# EAGLE design Ikea_Molgan (EAGLE 8.2.2)
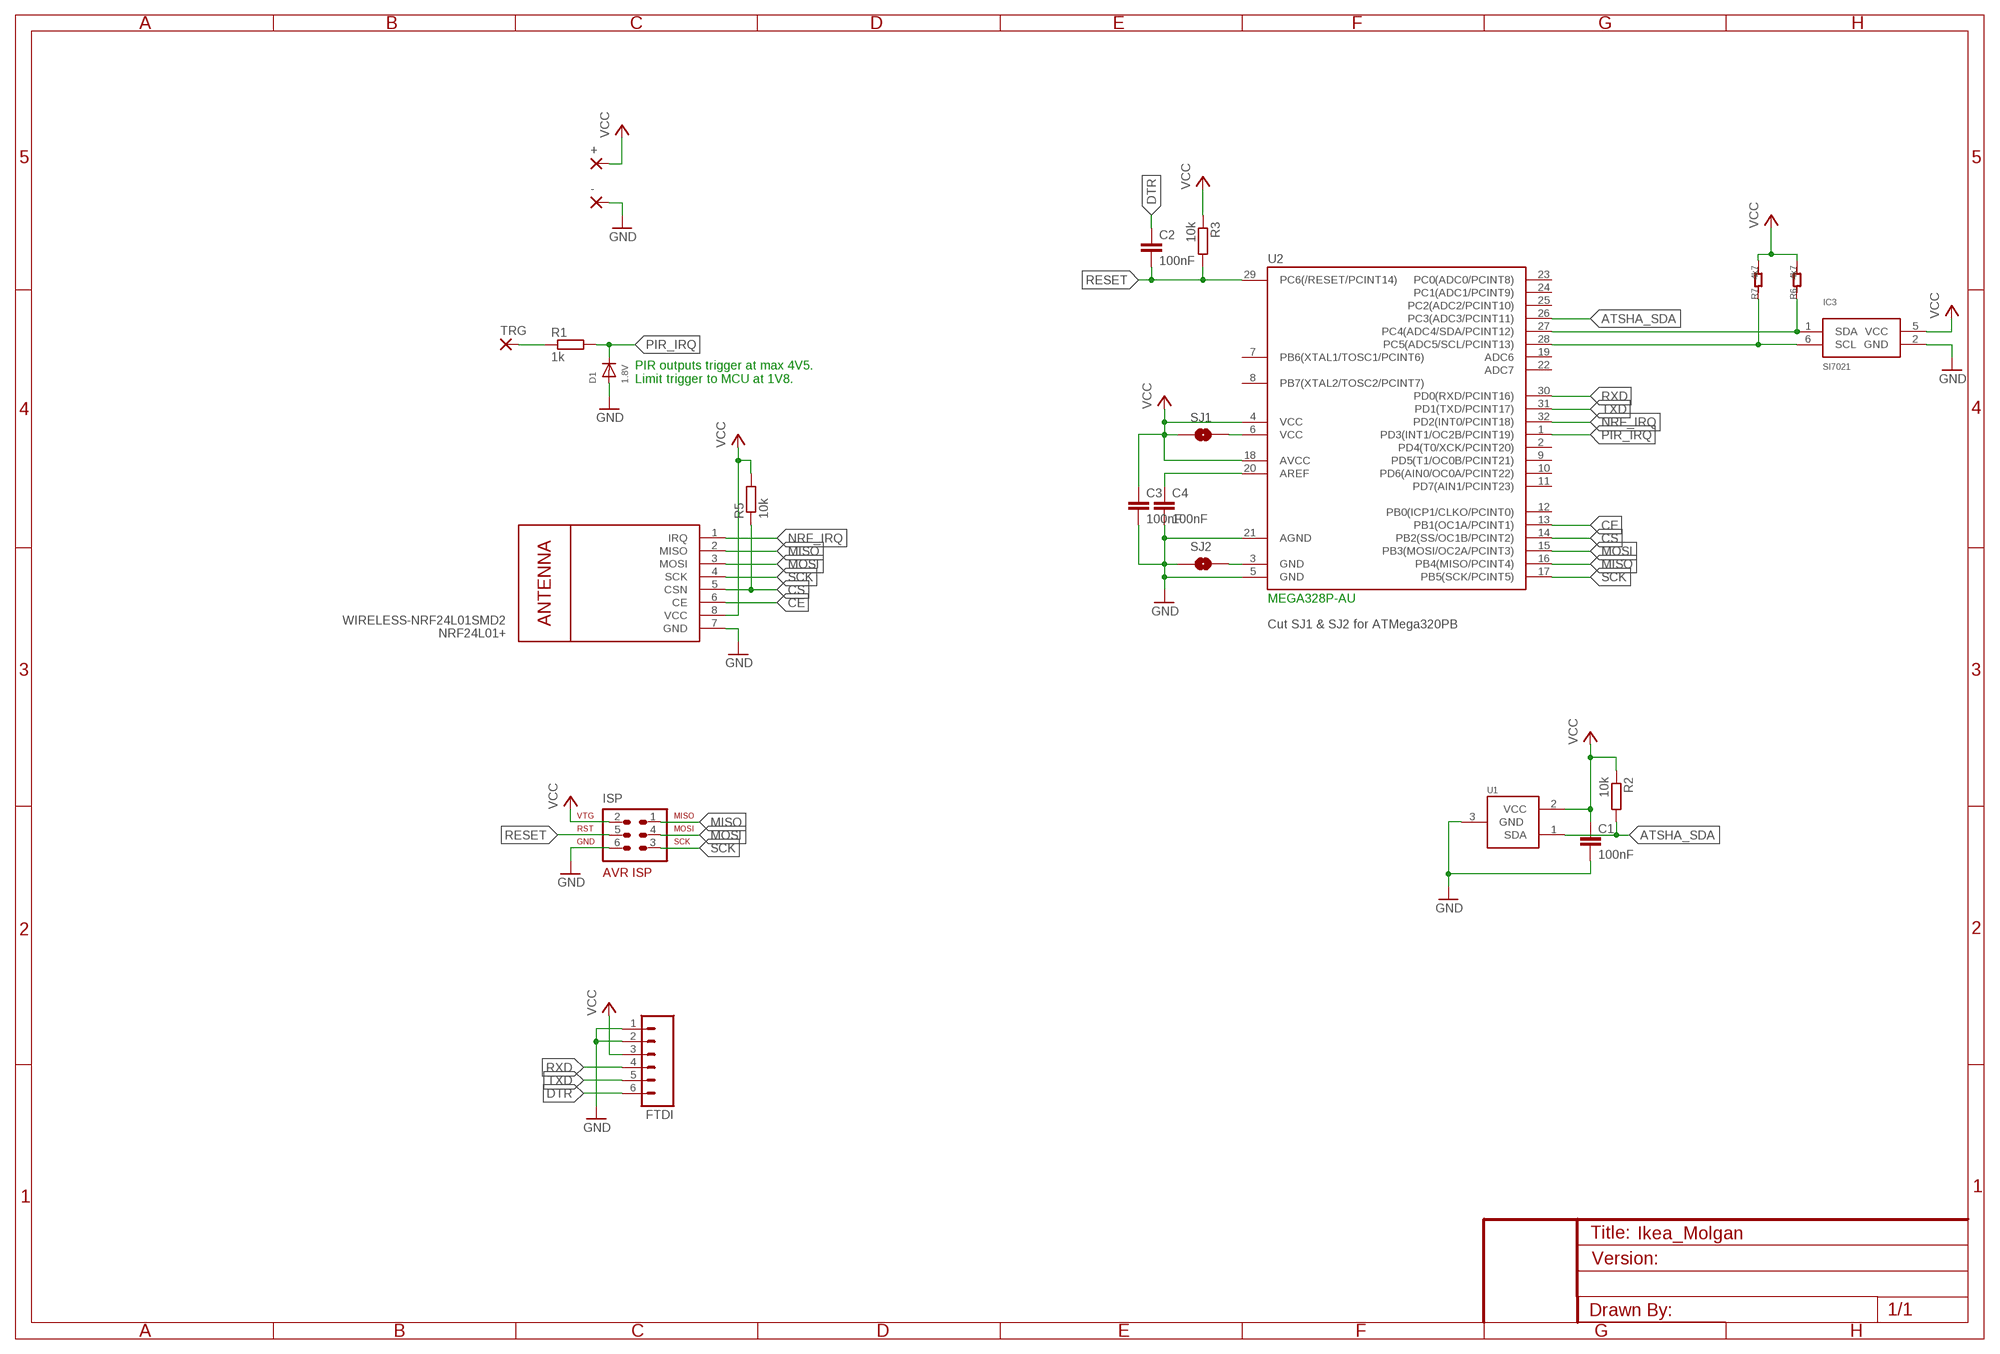
[diagram p0: schematic, sheet 1]

## Parts
+  WIREPADSMD2,54-5,08  [SMD2,54-5,08]
-  WIREPADSMD2,54-5,08  [SMD2,54-5,08]
C1  100nF  C-EUC0805  [C0805]
C2  100nF  C-EUC0805  [C0805]
C3  100nF  C-EUC0805  [C0805]
C4  100nF  C-EUC0805  [C0805]
D1  1.8V  DIODESOD-123  [SOD-123]
FTDI  M06SIP  [1X06]
IC3  SI7021  [DFN6]
ISP  AVR-ISP-6  [AVR-ISP-6]
NRF24L01+  WIRELESS-NRF24L01SMD2  [WIRELESS-NRF24L01-SMD-2]
R1  1k  R-EU_R0805  [R0805]
R2  10k  R-EU_R0805  [R0805]
R3  10k  R-EU_R0805  [R0805]
R5  10k  R-EU_R0805  [R0805]
R6  4k7  R-0402  [R0402]
R7  4k7  R-0402  [R0402]
SJ1  SOLDERJUMPERTRACE  [SJ_2S-TRACE]
SJ2  SOLDERJUMPERTRACE  [SJ_2S-TRACE]
TRG  WIREPADSMD2,54-5,08  [SMD2,54-5,08]
U1  IC_ATSHA204A_CRYPT  [SOT23-3]
U2  MEGA328P-AU  MEGA48/88/168-AU  [TQFP32-08]

## Nets
ATSHA_SDA: R2.2 U1.1(SDA) U2.26(PC3(ADC3/PCINT11))
CE: NRF24L01+.6(CE) U2.13(PB1(OC1A/PCINT1))
CS: NRF24L01+.5(CSN) R5.1 U2.14(PB2(SS/OC1B/PCINT2))
DTR: C2.1 FTDI.6
GND: -.1(P) C1.2 C3.2 C4.2 D1.A FTDI.1 FTDI.2 IC3.2(GND) ISP.6 NRF24L01+.7(GND) SJ2.1 U1.3(GND) U2.5(GND) U2.21(AGND)
MISO: ISP.1 NRF24L01+.2(MISO) U2.16(PB4(MISO/PCINT4))
MOSI: ISP.4 NRF24L01+.3(MOSI) U2.15(PB3(MOSI/OC2A/PCINT3))
N$1: R1.1 TRG.1(P)
N$4: SJ1.2 U2.6(VCC)
N$5: SJ2.2 U2.3(GND)
N$18: C4.1 U2.20(AREF)
NRF_IRQ: NRF24L01+.1(IRQ) U2.32(PD2(INT0/PCINT18))
PIR_IRQ: D1.C R1.2 U2.1(PD3(INT1/OC2B/PCINT19))
RESET: C2.2 ISP.5 R3.2 U2.29(PC6(/RESET/PCINT14))
RXD: FTDI.4 U2.30(PD0(RXD/PCINT16))
SCK: ISP.3 NRF24L01+.4(SCK) U2.17(PB5(SCK/PCINT5))
SCL: IC3.6(SCL) R7.1 U2.28(PC5(ADC5/SCL/PCINT13))
SDA: IC3.1(SDA) R6.1 U2.27(PC4(ADC4/SDA/PCINT12))
TXD: FTDI.5 U2.31(PD1(TXD/PCINT17))
VCC: +.1(P) C1.1 C3.1 FTDI.3 IC3.5(VCC) ISP.2 NRF24L01+.8(VCC) R2.1 R3.1 R5.2 R6.2 R7.2 SJ1.1 U1.2(VCC) U2.4(VCC) U2.18(AVCC)
Unconnected: U2.2(PD4(T0/XCK/PCINT20)) U2.7(PB6(XTAL1/TOSC1/PCINT6)) U2.8(PB7(XTAL2/TOSC2/PCINT7)) U2.9(PD5(T1/OC0B/PCINT21)) U2.10(PD6(AIN0/OC0A/PCINT22)) U2.11(PD7(AIN1/PCINT23)) U2.12(PB0(ICP1/CLKO/PCINT0)) U2.19(ADC6) U2.22(ADC7) U2.23(PC0(ADC0/PCINT8)) U2.24(PC1(ADC1/PCINT9)) U2.25(PC2(ADC2/PCINT10))

## Notes on the sheet
- PIR outputs trigger at max 4V5.
  Limit trigger to MCU at 1V8.
- Cut SJ1 & SJ2 for ATMega320PB

## Library data of the parts
+ - TRG = wirepad:WIREPAD: Wire PAD connect wire on PCB
C1-C4 = rcl:C-EU: CAPACITOR, European symbol
D1 = adafruit:DIODE: Diode SMADIODE - SMA Surface Mount Package 20V 1A Schottky Diode Digikey: 641-1014-6-ND DO-1N4148 - Through Hole Small Current Diode SOD-123 20V 1 A (.5mV Vf) Schottky Diode - Digikey: MBRX120TPMSCT-ND SOD-323 10V 570mA (.38mV Vf, 3ns) Schottky Diode - Digikey: ZLLS410CT-ND SOD-523 30V 30mA Schottky Diode (RB751S-40TE61) - Digikey: RB751S-40TE61CT-ND SOT23-R/W - SOT23 Package (R = Solder Paste/Reflow Ovens, W = Hand-Soldering) BAT54Film 40V 300mA - Digikey: 497-7162-1-ND
FTDI = SparkFun:M06: Header 6 Standard 6-pin 0.1" header. Use with straight break away headers (SKU : PRT-00116), right angle break away headers (PRT-00553), swiss pins (PRT-00743), machine pins (PRT-00117), and female headers (PRT-00115). Molex polarized connector foot print use with SKU : PRT-08094 with associated crimp pins and housings. NOTES ON THE VARIANTS LOCK and LOCK_LONGPADS... This footprint was designed to help hold the alignment of a through-hole component (i.e. 6-pin header) while soldering it into place. You may notice that each hole has been shifted either up or down by 0.005 of an inch from it's more standard position (which is a perfectly straight line). This slight alteration caused the pins (the squares in the middle) to touch the edges of the holes. Because they are alternating, it causes a "brace" to hold the component in place. 0.005 has proven to be the perfect amount of "off-center" position when using our standard breakaway headers. Although looks a little odd when you look at the bare footprint, once you have a header in there, the alteration is very hard to notice. Also, if you push a header all the way into place, it is covered up entirely on the bottom side. This idea of altering the position of holes to aid alignment will be further integrated into the Sparkfun Library for other footprints. It can help hold any component with 3 or more connection pins.
IC3 = Sensor:SI7021
ISP = avr-6:AVR-ISP-6: AVR ISP-6 Serial Programming Header
NRF24L01+ = nrf24l01plus:WIRELESS-NRF24L01: 2.4 GHz Wireless Module based on NRF24L01 chip
R1-R3 R5 = rcl:R-EU_: RESISTOR, European symbol
R6 R7 = Discrete:R*
SJ1 SJ2 = SparkFun:SOLDERJUMPER: Solder Jumper Standard SMD solder jumper. Used to automate production. Two varients : Normally Open and Normally Closed are the same, but have different paste layers. NC will have a large amount of paste and should jumper during reflow.
U1 = TD-MySensors:IC_ATSHA204A_CRYPT
U2 = avr-7:MEGA48/88/168

## Net classes
1 Power: width 0.406 mm

## Board
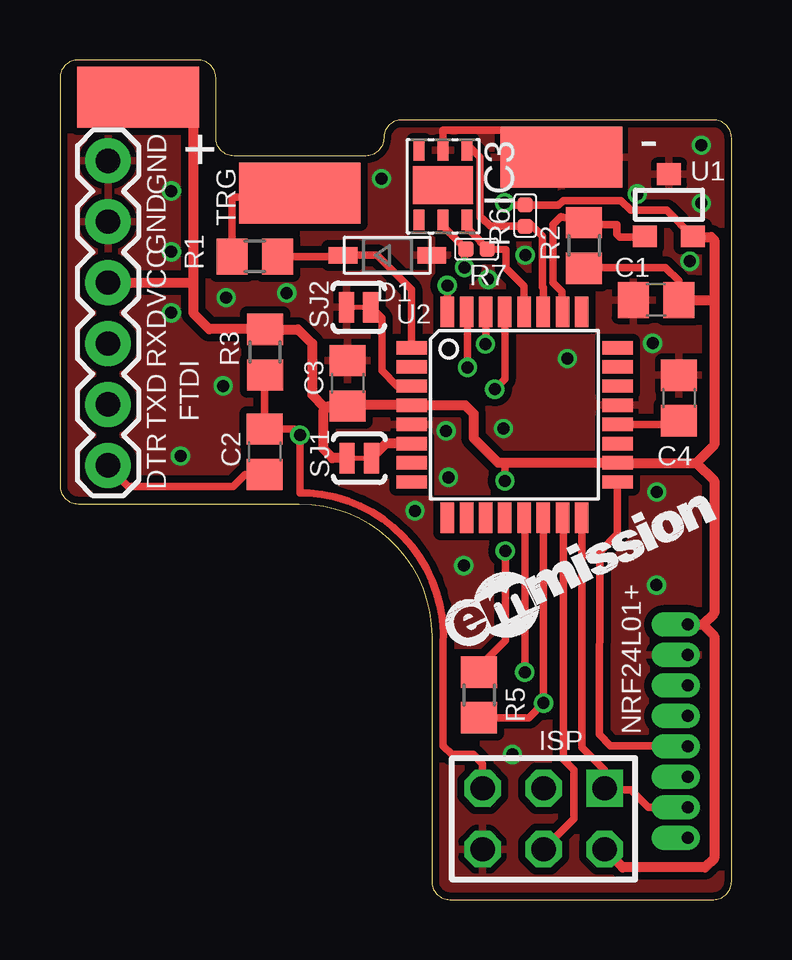
[diagram p1: board, top side]
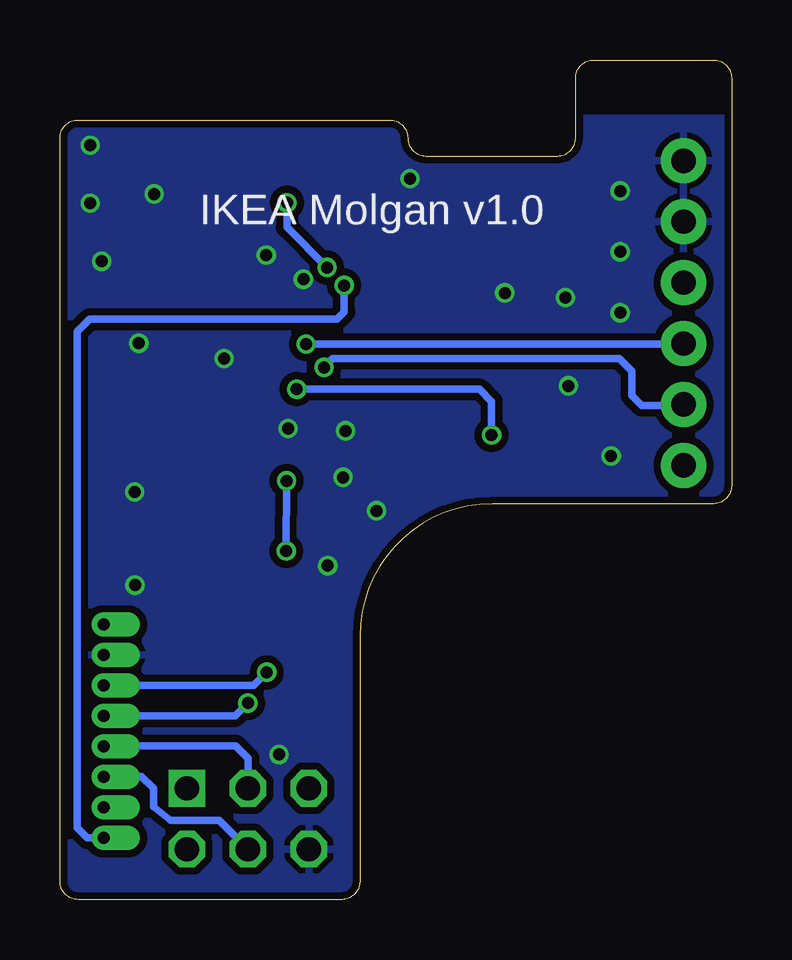
[diagram p2: board, bottom side, seen from below]

Size 28 x 35 mm. Coordinates in mm from the lower left corner, seen from the top.
Outline: 13.5,31.75 arc-90 12.75,31 7.25,31 arc-90 6.5,31.75 6.5,34.25 arc90 5.75,35 0.75,35 arc90 0,34.25 0,17.25 arc90 0.75,16.5 9.98,16.5 arc-90 15.5,10.98 15.5,0.75 arc90 16.25,0 27.25,0 arc90 28,0.75 28,31.75 arc90 27.25,32.5 14.25,32.5 arc90 13.5,31.75
Copper layers (1*16): Top 0.035mm / dielectric 1.5mm / Bottom 0.035mm
Design rules "dirt_cheap_dirty_boards.v1": minimum track width 5mil, minimum drill 12mil, track to track 5mil, track to pad 5mil, pad to pad 5mil, via to via 5mil, smd to smd 0mil, copper to edge 10mil, drill to drill 10mil, minimum pad ring 10mil, minimum via ring 6mil, stop-mask expansion 2mil, vias tented up to drill 25mil, thermal gap 10mil

### Footprints (pad centres in the part's own frame; a part is rotated, then mirrored left to right if it is on the bottom)
SMD2,54-5,08 = smd 2.54 x 5.08: 1 0,0
C0805 = smd 1.3 x 1.5: 1 -0.95,0; 2 0.95,0
SOD-123 = smd 1.2 x 0.7: A 1.85,0; C -1.85,0
1X06 = drill 1.016 pad 1.88: 1 0,0; 2 2.54,0; 3 5.08,0; 4 7.62,0; 5 10.16,0; 6 12.7,0
DFN6 = smd 0.85 x 0.45: 1 -1.45,1; 2 -1.45,0; 3 -1.45,-1; 4 1.45,-1; 5 1.45,0; 6 1.45,1 | smd 1.6 x 2.5: P$1 0,0
AVR-ISP-6 = drill 1.016 square: 1 -2.54,-1.27 | drill 1.016 octagon: 2 -2.54,1.27; 3 0,-1.27; 4 0,1.27; 5 2.54,-1.27; 6 2.54,1.27
WIRELESS-NRF24L01-SMD-2 = drill 0.5 pad 1.016 offset: 1 1.905,0; 2 1.905,1.27; 3 1.905,2.54; 4 1.905,3.81; 5 1.905,5.08; 6 1.905,6.35; 7 1.905,7.62; 8 1.905,8.89
R0805 = smd 1.3 x 1.5: 1 -0.95,0; 2 0.95,0
R0402 = smd 0.635 x 0.635: 1 0,0.445; 2 0,-0.445
SJ_2S-TRACE = smd 0.635 x 1.27: 1 -0.508,0; 2 0.508,0
SOT23-3 = smd 1 x 0.9: 1 -1,-1.3; 2 1,-1.3; 3 0,1.3
TQFP32-08 = smd 1.27 x 0.559: 1 -4.293,2.8; 2 -4.293,2; 3 -4.293,1.2; 4 -4.293,0.4; 5 -4.293,-0.4; 6 -4.293,-1.2; 7 -4.293,-2; 8 -4.293,-2.8; 17 4.293,-2.8; 18 4.293,-2; 19 4.293,-1.2; 20 4.293,-0.4; 21 4.293,0.4; 22 4.293,1.2; 23 4.293,2; 24 4.293,2.8 | smd 0.559 x 1.27: 9 -2.8,-4.293; 10 -2,-4.293; 11 -1.2,-4.293; 12 -0.4,-4.293; 13 0.4,-4.293; 14 1.2,-4.293; 15 2,-4.293; 16 2.8,-4.293; 25 2.8,4.293; 26 2,4.293; 27 1.2,4.293; 28 0.4,4.293; 29 -0.4,4.293; 30 -1.2,4.293; 31 -2,4.293; 32 -2.8,4.293

### Placement (x,y rotation side)
+  3.27,33.45 90 top
-  20.9,30.95 90 top
C1  24.85,25 180 top
C2  8.54,18.67 90 top
C3  12,21.52 90 top
C4  25.81,20.91 90 top
D1  13.65,26.86 0 top
FTDI  2,30.8 270 top
IC3  15.97,29.78 270 top
ISP  20.16,3.37 180 top
NRF24L01+  24.28,2.57 0 top
R1  8.13,26.81 0 top
R2  21.84,27.27 90 top
R3  8.55,22.82 270 top
R5  17.47,8.53 90 top
R6  19.4,28.51 180 top
R7  17.37,27.11 270 top
SJ1  12.48,18.4 0 top
SJ2  12.45,24.69 0 top
TRG  10,29.45 90 top
U1  25.39,28.94 0 top
U2  18.95,20.21 0 top
U$1  [EMMISSION_LOGO_12MM_NOTAG]  16.78,9.8 25.7 top

### Tracks (layer width: path | path; a pad name or v marks a point on that pad's centre or on a via)
ATSHA_SDA
  Top 0.305: U2.26 | U2.26 20.92,24.52 20.92,25.34 20.54,25.72 20.54,28.13 20.88,28.47 R2.2 arc90 21.93,28.13 23.21,28.13 23.21,27.75 23.34,27.62 24.37,27.62 U1.1
CE  (via drill 0.5)
  Top 0.305: v19.38,9.47 19.38,15.89 U2.13
  Bottom 0.305: NRF24L01+.6 19.93,8.92 v19.38,9.47
CS  (via drill 0.5)
  Top 0.305: U2.14 20.16,15.9 v20.16,8.19 19.56,7.58 R5.1
  Bottom 0.305: NRF24L01+.5 20.7,7.65 v20.16,8.19
DTR
  Top 0.305: C2.1 7.71,17.71 7.21,17.21 2.85,17.21 2,18.05 FTDI.6
GND  (via drill 0.5)
  Top 0.305: IC3.2 15.97,32.07 20.42,32.07 20.42,30.95 -.1
  other vias: 21.15,22.56 26.74,31.45 17.85,25.86 18.49,19.63 9.46,25.29 5.02,18.49 4.64,29.54 4.64,27 4.64,24.46 6.8,21.41 16.84,13.92 6.93,25.1 24.07,29.41 13.41,30.05 26.74,29.03 24.71,23.19 24.89,16.99 18.87,6.05 24.87,13.11 16.1,19.54 14.8,16.21 16.2,17.6 19.4,26.86 26.26,26.61
  pour Bottom (isolate 0.305): -0.28,32.58 28.01,32.58 28.26,-0.19 -0.03,-0.19
  pour Top (isolate 0.305): -0.03,35.37 28.26,35.37 28.26,-0.19 -0.03,-0.19
MISO
  Top 0.305: U2.16 21.75,6.35 22.7,5.4 ISP.1 22.76,4.57 23.79,4.57 24.53,3.84 NRF24L01+.2
MOSI
  Top 0.305: U2.15 20.99,15.88 20.99,5.84 21.43,5.4 21.43,3.37 ISP.4
  Bottom 0.305: NRF24L01+.3 26.15,5.14 24.61,5.14 24.1,4.64 24.1,3.87 23.38,3.3 21.37,3.3 ISP.4 20.21,2.1
N$1
  Top 0.305: 10.4,29.84 TRG.1 10,29.27 7.18,29.27 R1.1
N$4
  Top 0.406: U2.6 13.59,19.01 SJ1.2
N$5
  Top 0.305: U2.3 14.06,21.41 13.42,22.05 13.42,24.23 SJ2.2
N$18
  Top 0.305: U2.20 25.8,19.81 C4.1
NRF_IRQ  (via drill 0.5)
  Top 0.305: v16.15,25.6 U2.32 | U2.32
  Bottom 0.305: NRF24L01+.1 26.86,2.57 27.27,2.99 27.27,23.69 26.77,24.19 16.46,24.19 U2.32 16.15,25.49 v16.15,25.6
PIR_IRQ
  Top 0.305: R1.2 11.75,26.81 D1.C 13.22,26.86 14.65,25.43 U2.1
RESET  (via drill 0.5)
  Top 0.305: U2.29 | U2.29 18.55,21.69 v18.13,21.27 | R3.2 C2.2 9.76,19.61 v10,19.37 10,16.95 10.38,16.95 arc-90 15.97,10.61 15.97,6.41 16.34,6.04 17.23,6.04 17.62,5.65 ISP.5
  Bottom 0.305: v18.13,21.27 10.51,21.27 10,20.77 v10,19.37
RXD  (via drill 0.5)
  Top 0.305: U2.30 17.75,23.51 v17.74,23.15
  Bottom 0.305: v17.74,23.15 2,23.15 FTDI.4
SCK
  Top 0.305: U2.17 23.24,15.24 22.5,14.5 22.48,6.89 22.96,6.41 26.15,6.41 NRF24L01+.4
  Bottom 0.305: NRF24L01+.4 26.15,6.41 20.67,6.41 20.15,5.89 ISP.3
SCL
  Top 0.305: U2.28 19.35,25.57 18.59,26.32 18.59,27.1 R7.1 17.52,27.41 17.52,27.45 16.97,28.01 IC3.6
SDA
  Top 0.305: U2.27 20.15,25.5 20.11,25.54 20.11,27.66 19.61,28.16 19.57,28.16 R6.1 17.94,28.07 17.62,28.38 arc-90 17.5,28.51 17.5,30.95 16.97,31.48 IC3.1
TXD  (via drill 0.5)
  Top 0.305: v16.99,22.19 16.99,24.46 U2.31
  Bottom 0.305: v16.99,22.19 16.63,22.54 4.67,22.54 4.16,22.04 4.16,21.02 3.73,20.59 2.05,20.59 FTDI.5
VCC  (via drill 0.5)
  Top 0.305: +.1 5.56,33.45 | 12.31,20.61 C3.1 | C1.1 25.8,25.79 25.24,26.35 22.06,26.35 R2.1 | R5.2 17.47,9.71 18.56,10.8 v18.56,14.53 | v18.55,17.46 18.55,18.21 | IC3.5 15.97,28.07 R7.2 16.86,27.05 v16.86,26.35 | U1.2 25.29,28.73 23.79,28.73 23.38,29.14 20.98,29.14 20.79,28.96 R6.2 18.7,28.96 18.64,28.89 18.64,28.95 v18.54,29.05
  Top 0.406: NRF24L01+.8 26.8,11.46 | 26.8,11.46 27.27,10.99 27.27,1.71 26.89,1.33 23.47,1.33 ISP.2 | 26.53,18.21 U2.18 18.55,18.21 18.28,18.21 17.24,19.24 17.24,20.26 16.89,20.61 U2.4 12.31,20.61 | 26.53,18.21 27.27,17.46 27.27,11.93 26.8,11.46 | 27.27,25.08 27.27,27.5 27.15,27.62 26.4,27.62 U1.2 | 27.27,25.08 27.27,18.95 26.53,18.21 | 11.18,20.56 10.99,20.56 10.51,21.04 10.51,23.18 9.92,23.77 R3.1 6.23,23.78 5.56,24.45 5.56,25.72 | 11.18,20.56 12.24,20.56 C3.1 | 5.56,33.45 5.56,25.72 | C1.1 27.19,25 27.27,25.08 | FTDI.3 5.56,25.72 | SJ1.1 11.36,18.4 10.98,18.78 10.98,20.36 11.18,20.56
  Bottom 0.305: v18.56,14.53 v18.55,17.46 | v18.54,29.05 18.54,28.03 v16.86,26.35

### Text on the board
tPlace: GND | GND | VCC | RXD | TXD | DTR
bPlace: IKEA Molgan v1.0